# EAGLE design core (EAGLE 9.6.2)
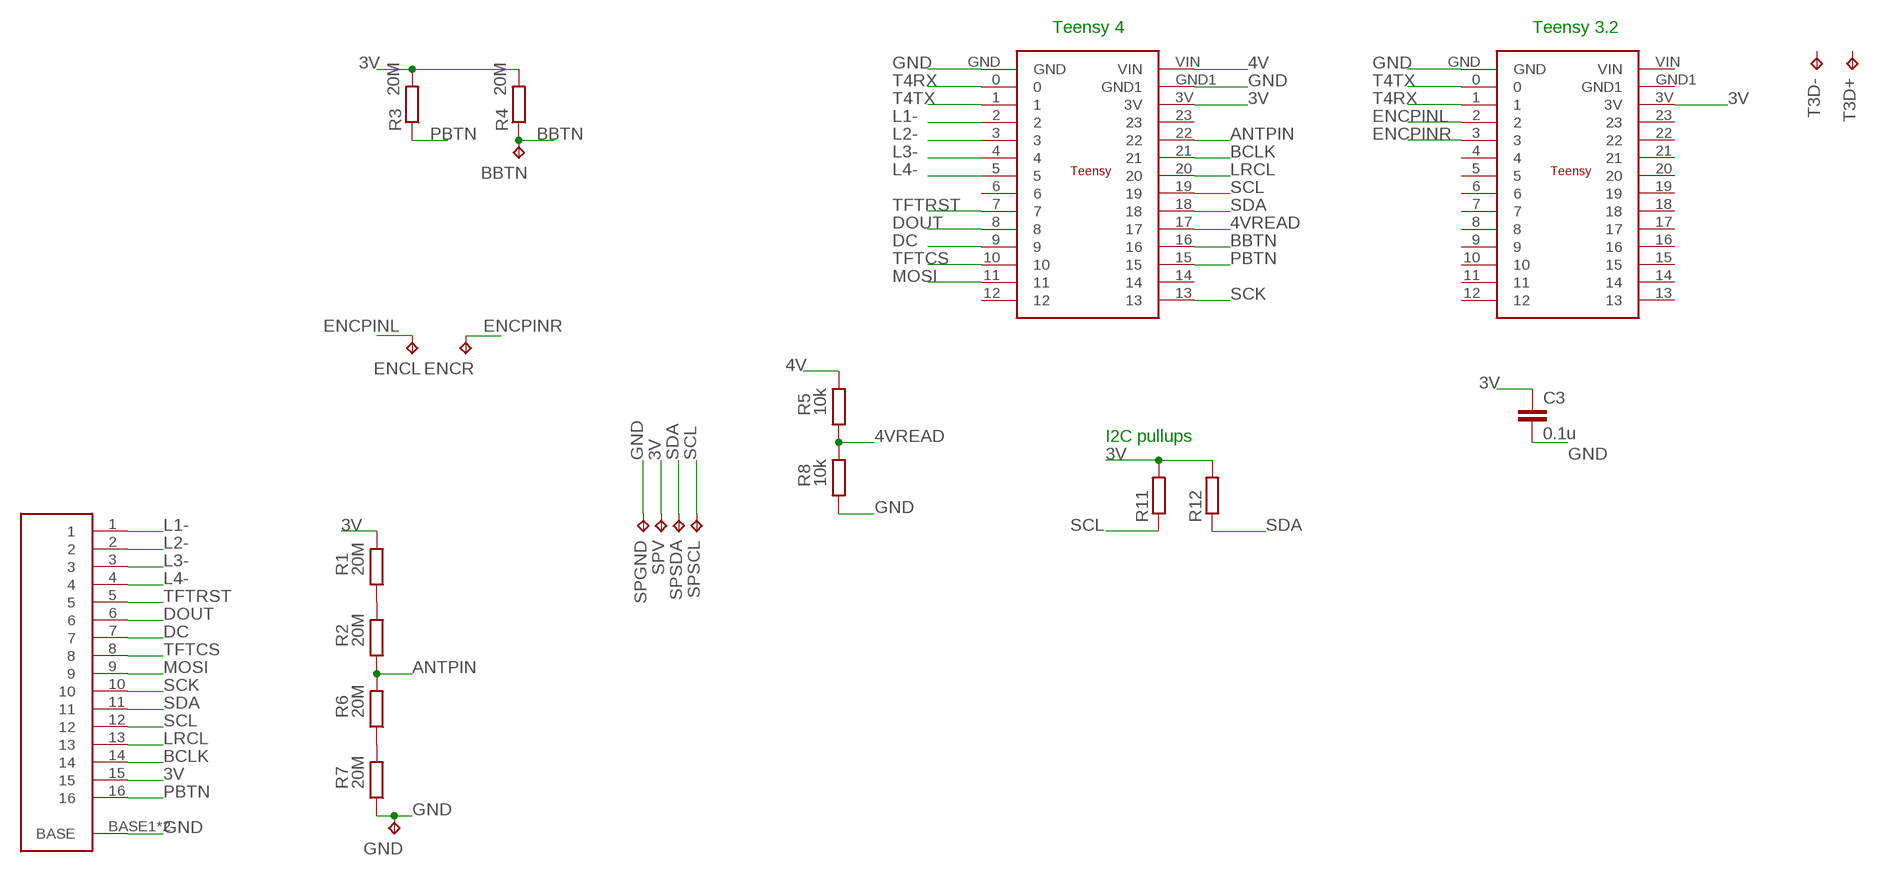
[diagram p0: schematic, sheet 1]

## Parts
BBTN  TPTP14R  [TP14R]
C3  0.1u  C-EUC0805  [C0805]
ENCL  TPTP14R  [TP14R]
ENCR  TPTP14R  [TP14R]
GND  TPTP14R  [TP14R]
R1  20M  R-EU_M0805  [M0805]
R2  20M  R-EU_M0805  [M0805]
R3  20M  R-EU_M0805  [M0805]
R4  20M  R-EU_M0805  [M0805]
R5  10k  R-EU_M0805  [M0805]
R6  20M  R-EU_M0805  [M0805]
R7  20M  R-EU_M0805  [M0805]
R8  10k  R-EU_M0805  [M0805]
R11  R-EU_R0805  [R0805]
R12  R-EU_R0805  [R0805]
SPGND  TPTP14R  [TP14R]
SPSCL  TPTP14R  [TP14R]
SPSDA  TPTP14R  [TP14R]
SPV  TPTP14R  [TP14R]
T3D+  TPTP14R  [TP14R]
T3D-  TPTP14R  [TP14R]
U$1  TEENSY4  TEENSYSMALL  [TEENSYSMALL]
U$2  TEENSYSMALL  [TEENSYSMALL]
U$3  16PINFFC  [16PINFFC]

## Nets
3V [battery]: C3.1 R1.2 R3.2 R4.2 R11.2 R12.2 SPV.TP U$1.3V U$2.3V U$3.15
4V [battery]: R5.2 U$1.VIN
4VREAD: R5.1 R8.2 U$1.17
ANTPIN: R2.1 R6.2 U$1.22
BBTN: BBTN.TP R4.1 U$1.16
BCLK: U$1.21 U$3.14
DC: U$1.9 U$3.7
DOUT: U$1.8 U$3.6
ENCPINL: ENCL.TP U$2.2
ENCPINR: ENCR.TP U$2.3
GND [battery]: C3.2 GND.TP R7.1 R8.1 SPGND.TP U$1.GND U$1.GND1 U$2.GND U$3.BASE1(BASE) U$3.BASE2(BASE)
L1-: U$1.2 U$3.1
L2-: U$1.3 U$3.2
L3-: U$1.4 U$3.3
L4-: U$1.5 U$3.4
LRCL: U$1.20 U$3.13
MOSI: U$1.11 U$3.9
N$6: R6.1 R7.2
N$7: R1.1 R2.2
PBTN: R3.1 U$1.15 U$3.16
SCK: U$1.13 U$3.10
SCL: R11.1 SPSCL.TP U$1.19 U$3.12
SDA: R12.1 SPSDA.TP U$1.18 U$3.11
T4RX: U$1.0 U$2.1
T4TX: U$1.1 U$2.0
TFTCS: U$1.10 U$3.8
TFTRST: U$1.7 U$3.5
Unconnected: T3D+.TP T3D-.TP U$1.6 U$1.12 U$1.14 U$1.23 U$2.4 U$2.5 U$2.6 U$2.7 U$2.8 U$2.9 U$2.10 U$2.11 U$2.12 U$2.13 U$2.14 U$2.15 U$2.16 U$2.17 U$2.18 U$2.19 U$2.20 U$2.21 U$2.22 U$2.23 U$2.GND1 U$2.VIN

## Notes on the sheet
- Teensy 4 | Teensy 3.2
- I2C pullups

## Library data of the parts
BBTN ENCL ENCR GND SPGND SPSCL SPSDA SPV T3D+ T3D- = testpad:TP: Test pad
C3 = resistor:C-EU: CAPACITOR, European symbol
R1-R8 R11 R12 = resistor:R-EU_: RESISTOR, European symbol
U$1 U$2 = general:TEENSYSMALL
U$3 = general:16PINFFC

## Net classes
0 default: width 0.152 mm, clearance 0.152 mm
1 battery: width 0.305 mm, clearance 0.152 mm

## Board
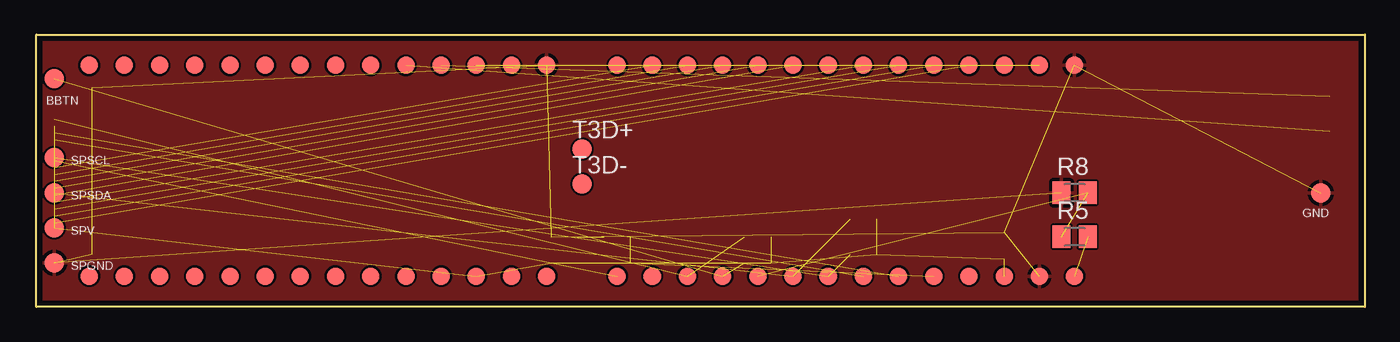
[diagram p1: board, top side]
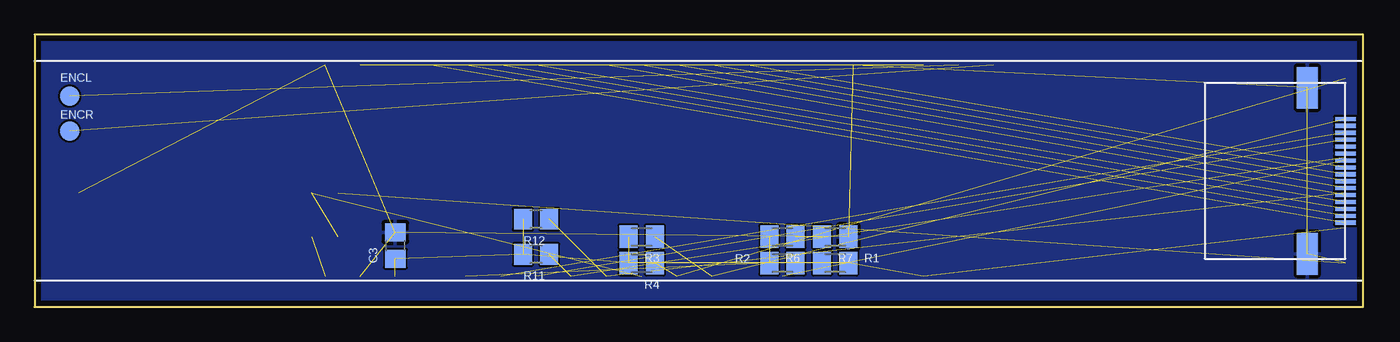
[diagram p2: board, bottom side, seen from below]

Size 95.89 x 19.68 mm. Coordinates in mm from the lower left corner, seen from the top.
Outline: 95.89,0 0,0 0,19.68 95.89,19.68 95.89,0
Copper layers (1*16): Top 0.035mm / dielectric 1.5mm / Bottom 0.035mm
Design rules "default *": minimum track width 6mil, minimum drill 0.35mm, track to track 6mil, track to pad 6mil, pad to pad 6mil, via to via 6mil, smd to smd 6mil, copper to edge 15mil, drill to drill 6mil, minimum pad ring 10mil, minimum via ring 8mil, stop-mask expansion 4mil, vias tented up to drill 0mil, thermal gap 10mil

### Footprints (pad centres in the part's own frame; a part is rotated, then mirrored left to right if it is on the bottom)
TP14R = smd 1.4 x 1.4: TP 0,0
C0805 = smd 1.3 x 1.5: 1 -0.95,0; 2 0.95,0
M0805 = smd 1.3 x 1.6: 1 -0.95,0; 2 0.95,0
R0805 = smd 1.3 x 1.5: 1 -0.95,0; 2 0.95,0
TEENSYSMALL = smd 1.27 x 1.27: 0 -12.7,-7.62; 1 -10.16,-7.62; 2 -7.62,-7.62; 3 -5.08,-7.62; 3V -10.16,7.62; 4 -2.54,-7.62; 5 0,-7.62; 6 2.54,-7.62; 7 5.08,-7.62; 8 7.62,-7.62; 9 10.16,-7.62; 10 12.7,-7.62; 11 15.24,-7.62; 12 17.78,-7.62; 13 17.78,7.62; 14 15.24,7.62; 15 12.7,7.62; 16 10.16,7.62; 17 7.62,7.62; 18 5.08,7.62; 19 2.54,7.62; 20 0,7.62; 21 -2.54,7.62; 22 -5.08,7.62; 23 -7.62,7.62; GND -15.24,-7.62; GND1 -12.7,7.62; VIN -15.24,7.62
16PINFFC = smd 0.3 x 1.5: 1 -3.75,0; 2 -3.25,0; 3 -2.75,0; 4 -2.25,0; 5 -1.75,0; 6 -1.25,0; 7 -0.75,0; 8 -0.25,0; 9 0.25,0; 10 0.75,0; 11 1.25,0; 12 1.75,0; 13 2.25,0; 14 2.75,0; 15 3.25,0; 16 3.75,0 | smd 3 x 1.5: BASE1 -6,2.75; BASE2 6,2.75

### Placement (x,y rotation side)
BBTN  1.27,16.51 0 top
C3  69.85,4.45 90 bottom
ENCL  93.34,15.24 0 bottom
ENCR  93.34,12.7 0 bottom
GND  92.71,8.26 0 top
R1  38.1,3.17 0 bottom
R2  41.91,3.17 0 bottom
R3  52.07,5.08 180 bottom
R4  52.07,3.17 180 bottom
R5  74.93,5.08 0 top
R6  41.91,5.08 180 bottom
R7  38.1,5.08 180 bottom
R8  74.93,8.26 0 top
R11  59.69,3.81 180 bottom
R12  59.69,6.35 180 bottom
SPGND  1.27,3.17 0 top
SPSCL  1.27,10.79 0 top
SPSDA  1.27,8.26 0 top
SPV  1.27,5.71 0 top
T3D+  39.37,11.43 0 top
T3D-  39.37,8.89 0 top
U$1  59.69,9.84 180 top
U$2  21.59,9.84 180 top
U$3  1.27,9.84 90 bottom

### Tracks (layer width: path | path; a pad name or v marks a point on that pad's centre or on a via)
3V  (9 unrouted)
4V  (1 unrouted)
4VREAD  (2 unrouted)
ANTPIN  (2 unrouted)
BBTN  (2 unrouted)
BCLK  (1 unrouted)
DC  (1 unrouted)
DOUT  (1 unrouted)
ENCPINL  (1 unrouted)
ENCPINR  (1 unrouted)
GND  (9 unrouted)
  pour Top: -0.64,-0.64 -0.64,20.32 104.14,20.32 104.14,-0.64
  pour Bottom: -1.27,-1.27 -1.27,20.95 104.78,20.95 104.78,-1.27
L1-  (1 unrouted)
L2-  (1 unrouted)
L3-  (1 unrouted)
L4-  (1 unrouted)
LRCL  (1 unrouted)
MOSI  (1 unrouted)
N$6  (1 unrouted)
N$7  (1 unrouted)
PBTN  (2 unrouted)
SCK  (1 unrouted)
SCL  (3 unrouted)
SDA  (3 unrouted)
T4RX  (1 unrouted)
T4TX  (1 unrouted)
TFTCS  (1 unrouted)
TFTRST  (1 unrouted)